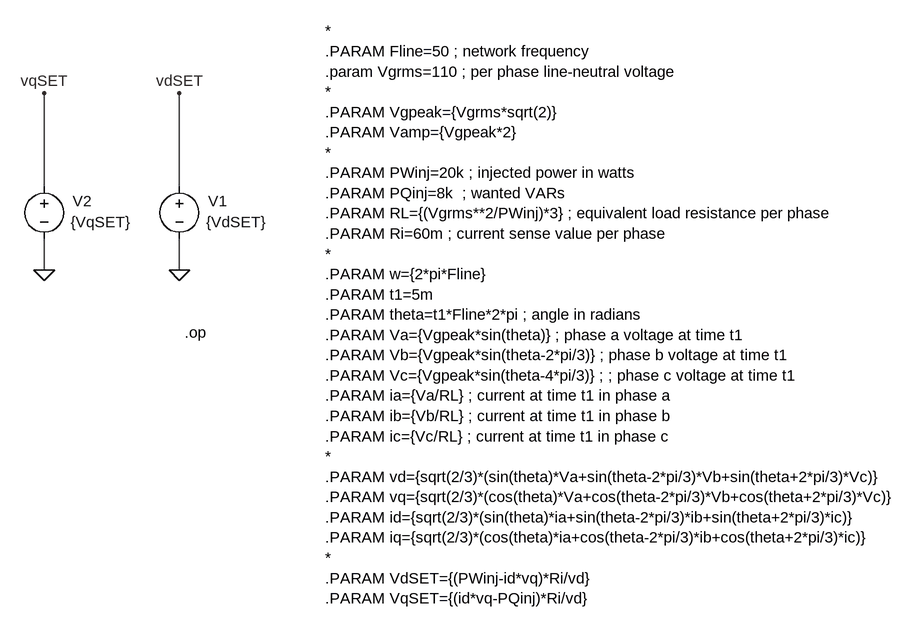
[diagram p0: schematic dq calculation test.asc]
dq calculation test.asc, the LTspice schematic file:
Version 4.1
SHEET 1 1028 680
WIRE -656 -128 -656 -272
WIRE -448 -128 -448 -272
WIRE -656 0 -656 -48
WIRE -448 0 -448 -48
FLAG -448 0 0
FLAG -448 -272 vdSET
FLAG -656 0 0
FLAG -656 -272 vqSET
DATAFLAG -656 -192 ""
DATAFLAG -448 -192 ""
SYMBOL voltage -448 -144 R0
WINDOW 0 44 38 Left 2
WINDOW 3 41 70 Left 2
WINDOW 123 0 0 Left 0
WINDOW 39 0 0 Left 0
SYMATTR InstName V1
SYMATTR Value {VdSET}
SYMBOL voltage -656 -144 R0
WINDOW 0 44 38 Left 2
WINDOW 3 41 70 Left 2
WINDOW 123 0 0 Left 0
WINDOW 39 0 0 Left 0
SYMATTR InstName V2
SYMATTR Value {VqSET}
TEXT -224 -368 Left 2 !*\n.PARAM Fline=50 ; network frequency\n.param Vgrms=110 ; per phase line-neutral voltage\n*\n.PARAM Vgpeak={Vgrms*sqrt(2)}\n.PARAM Vamp={Vgpeak*2}\n*\n.PARAM PWinj=20k ; injected power in watts\n.PARAM PQinj=8k  ; wanted VARs\n.PARAM RL={(Vgrms**2/PWinj)*3} ; equivalent load resistance per phase\n.PARAM Ri=60m ; current sense value per phase\n*\n.PARAM w={2*pi*Fline}\n.PARAM t1=5m\n.PARAM theta=t1*Fline*2*pi ; angle in radians\n.PARAM Va={Vgpeak*sin(theta)} ; phase a voltage at time t1\n.PARAM Vb={Vgpeak*sin(theta-2*pi/3)} ; phase b voltage at time t1\n.PARAM Vc={Vgpeak*sin(theta-4*pi/3)} ; ; phase c voltage at time t1\n.PARAM ia={Va/RL} ; current at time t1 in phase a\n.PARAM ib={Vb/RL} ; current at time t1 in phase b\n.PARAM ic={Vc/RL} ; current at time t1 in phase c\n*\n.PARAM vd={sqrt(2/3)*(sin(theta)*Va+sin(theta-2*pi/3)*Vb+sin(theta+2*pi/3)*Vc)}\n.PARAM vq={sqrt(2/3)*(cos(theta)*Va+cos(theta-2*pi/3)*Vb+cos(theta+2*pi/3)*Vc)}\n.PARAM id={sqrt(2/3)*(sin(theta)*ia+sin(theta-2*pi/3)*ib+sin(theta+2*pi/3)*ic)}\n.PARAM iq={sqrt(2/3)*(cos(theta)*ia+cos(theta-2*pi/3)*ib+cos(theta+2*pi/3)*ic)}\n*\n.PARAM VdSET={(PWinj-id*vq)*Ri/vd}\n.PARAM VqSET={(id*vq-PQinj)*Ri/vd}
TEXT -440 96 Left 2 !.op

The netlist it stands for:
* dq calculation test.asc
V1 vdSET 0 {VdSET}
V2 vqSET 0 {VqSET}
*
.PARAM Fline=50 ; network frequency
.param Vgrms=110 ; per phase line-neutral voltage
*
.PARAM Vgpeak={Vgrms*sqrt(2)}
.PARAM Vamp={Vgpeak*2}
*
.PARAM PWinj=20k ; injected power in watts
.PARAM PQinj=8k  ; wanted VARs
.PARAM RL={(Vgrms**2/PWinj)*3} ; equivalent load resistance per phase
.PARAM Ri=60m ; current sense value per phase
*
.PARAM w={2*pi*Fline}
.PARAM t1=5m
.PARAM theta=t1*Fline*2*pi ; angle in radians
.PARAM Va={Vgpeak*sin(theta)} ; phase a voltage at time t1
.PARAM Vb={Vgpeak*sin(theta-2*pi/3)} ; phase b voltage at time t1
.PARAM Vc={Vgpeak*sin(theta-4*pi/3)} ; ; phase c voltage at time t1
.PARAM ia={Va/RL} ; current at time t1 in phase a
.PARAM ib={Vb/RL} ; current at time t1 in phase b
.PARAM ic={Vc/RL} ; current at time t1 in phase c
*
.PARAM vd={sqrt(2/3)*(sin(theta)*Va+sin(theta-2*pi/3)*Vb+sin(theta+2*pi/3)*Vc)}
.PARAM vq={sqrt(2/3)*(cos(theta)*Va+cos(theta-2*pi/3)*Vb+cos(theta+2*pi/3)*Vc)}
.PARAM id={sqrt(2/3)*(sin(theta)*ia+sin(theta-2*pi/3)*ib+sin(theta+2*pi/3)*ic)}
.PARAM iq={sqrt(2/3)*(cos(theta)*ia+cos(theta-2*pi/3)*ib+cos(theta+2*pi/3)*ic)}
*
.PARAM VdSET={(PWinj-id*vq)*Ri/vd}
.PARAM VqSET={(id*vq-PQinj)*Ri/vd}
.op
.backanno
.end